# EasyEDA schematic HAT-MAGIC-HOOVER-BASE.json
TITLE: Sheet_1; REV: 1.0; Date: 2024-09-30; Sheet: 1/1; Drawn By: SMHOSY; Company: Your Company
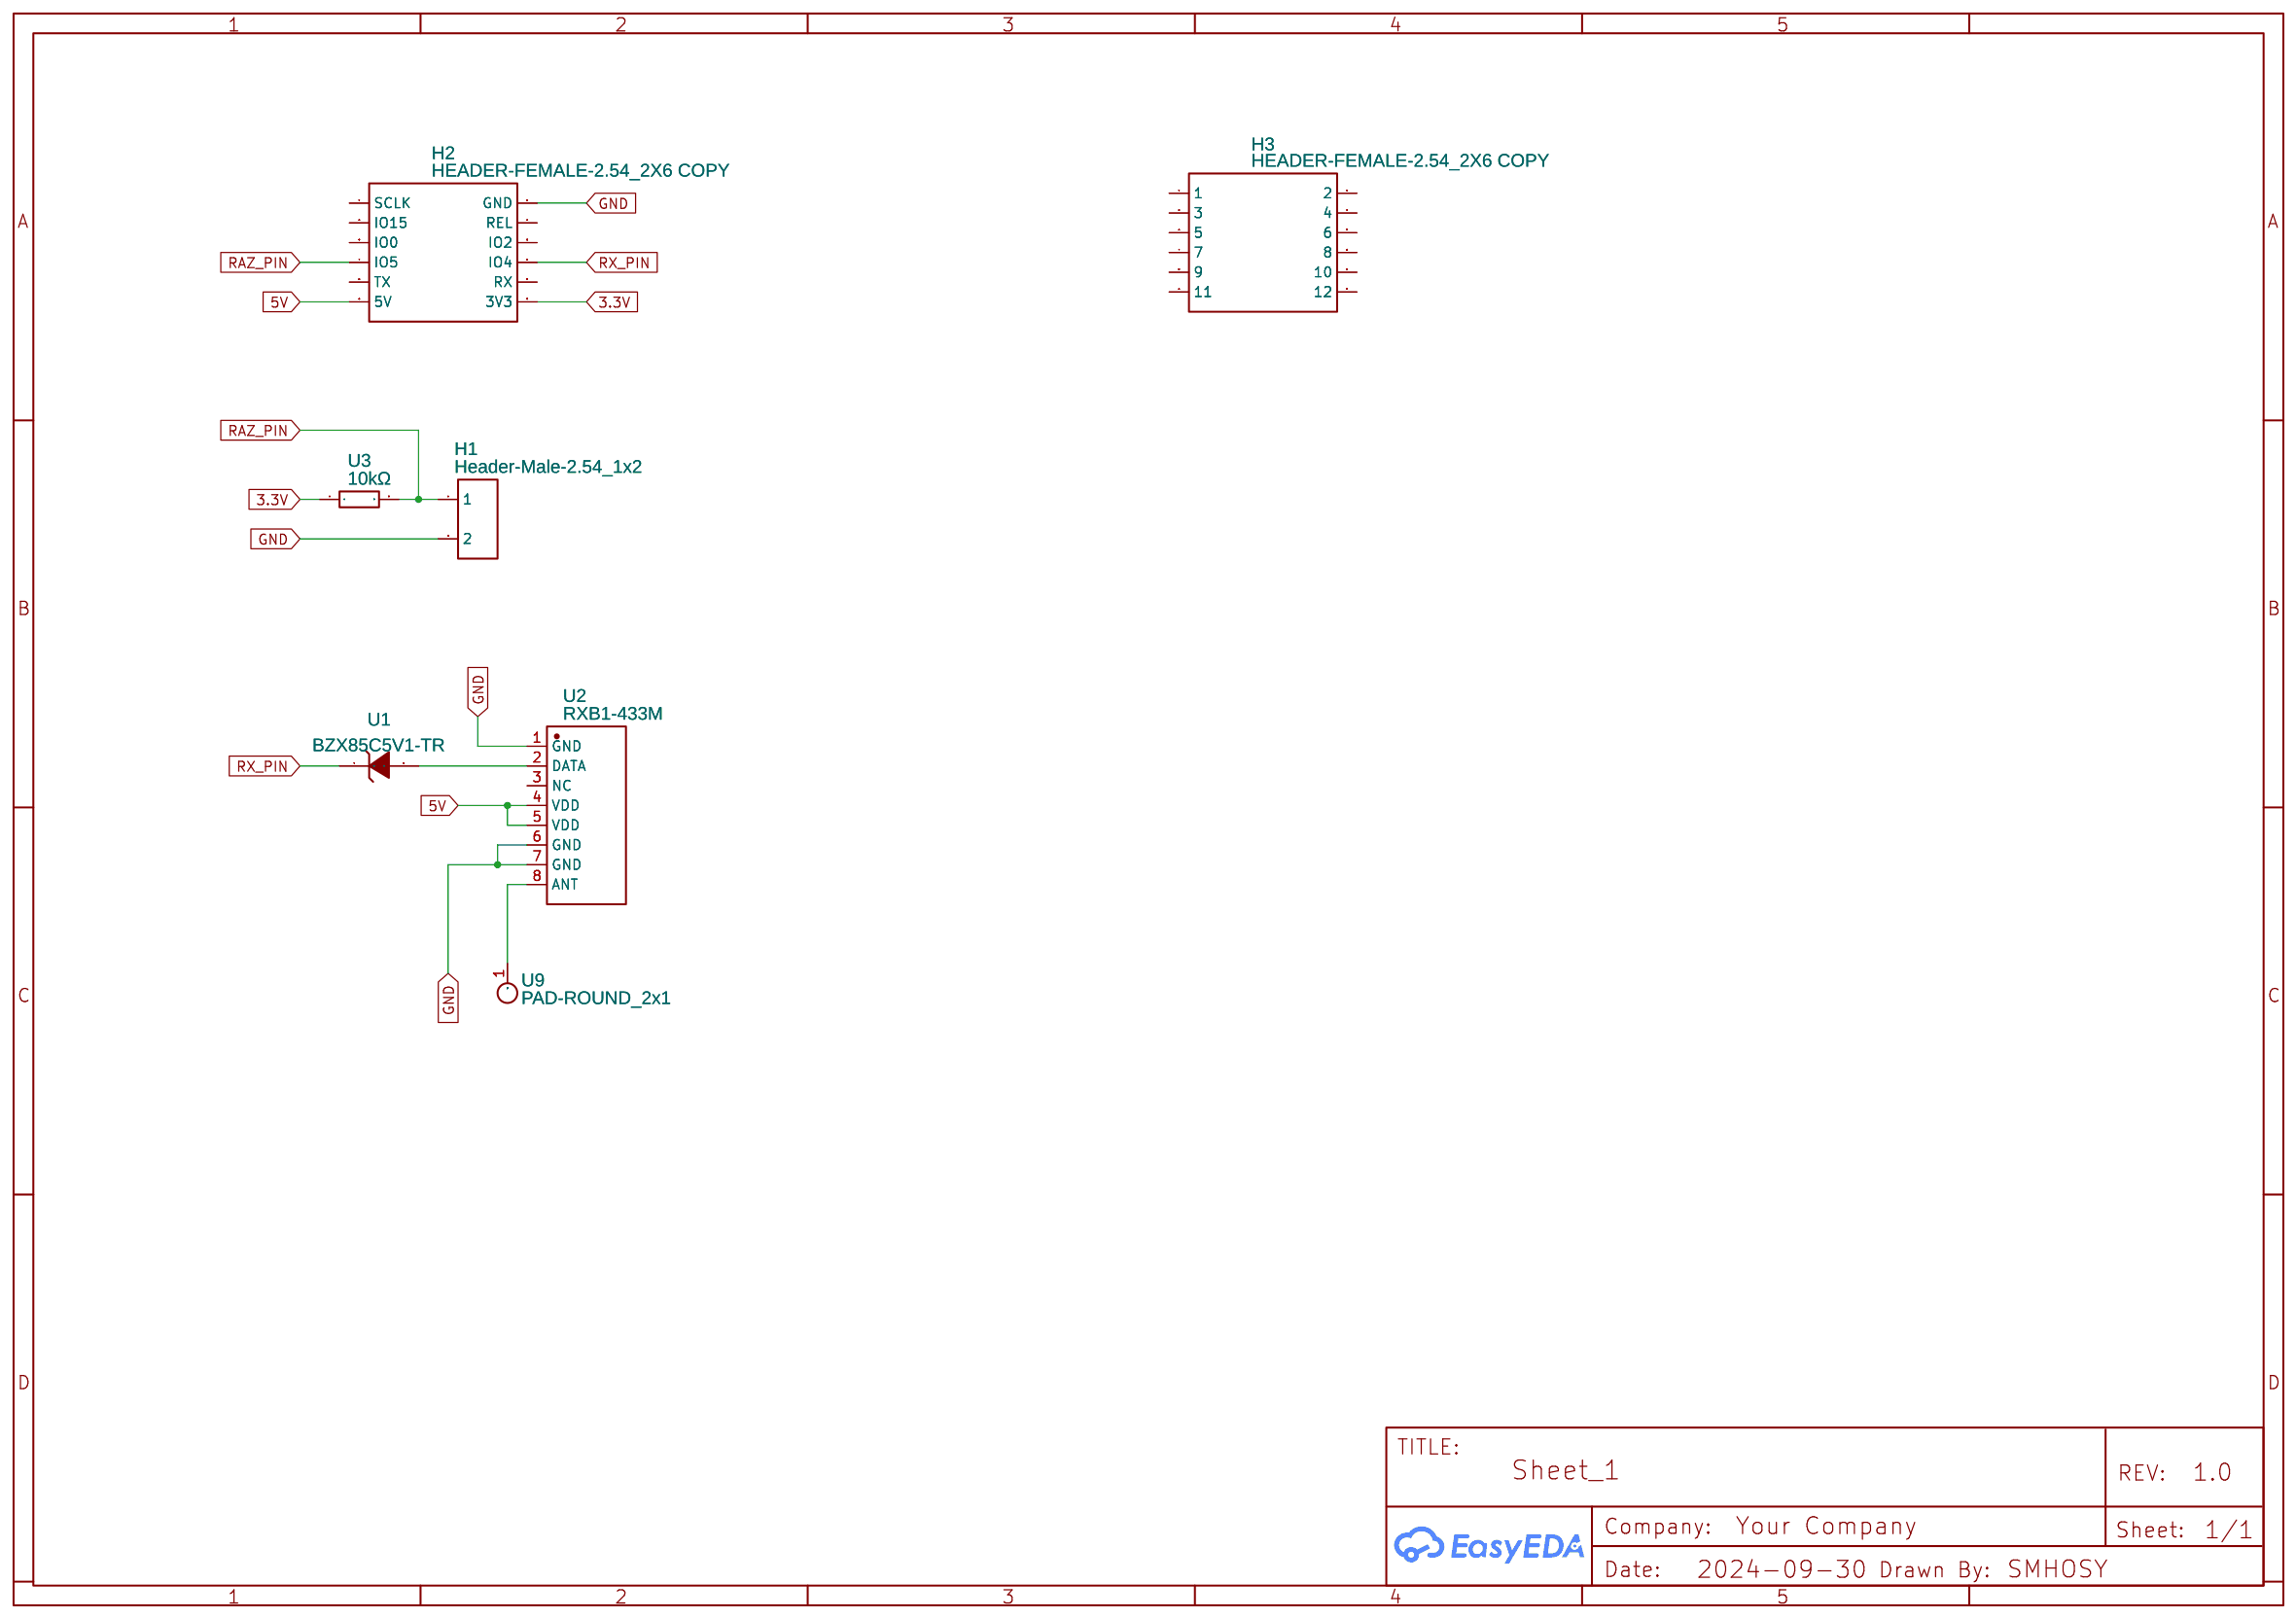
[diagram p0: schematic sheet]

## Parts
H1  Header-Male-2.54_1x2  [HDR-TH_2P-P2.54-V-M-1]
H2  HEADER-FEMALE-2.54_2X6 COPY  [HDR-TH_12P-P2.54-V-F-R2-C6-S2.54]
H3  HEADER-FEMALE-2.54_2X6 COPY  [HDR-TH_12P-P2.54-V-F-R2-C6-S2.54]
U1  BZX85C5V1-TR  [DO-41_BD1.9-L3.3-P7.30-D0.8-RD]
U2  RXB1-433M  [WIRELM-TH_RXB1-433M]
U3  10kΩ  [R1206]
U9  PAD-ROUND_2x1  [PADPAD]

## Library data of the parts
H1 = Header-Male-2.54_1x2: Supplier: LCSC; Manufacturer: TE Connectivity(泰科电子); Manufacturer Part: 826629-2; Supplier Part: C86471; JLCPCB Part Class: Extended Part
H2 H3 = HEADER-FEMALE-2.54_2X6 COPY: Supplier: LCSC; Manufacturer: BOOMELE(博穆精密); Manufacturer Part: 2.54-2*6P母; Supplier Part: C36191; JLCPCB Part Class: Extended Part
U1 = BZX85C5V1-TR: Contributor: lcsc; Supplier: LCSC; Supplier Part: C3000843; Manufacturer: VISHAY(威世); JLCPCB Part Class: Extended Part
U2 = RXB1-433M: Contributor: LCSC; Supplier: LCSC; Supplier Part: C717940; Manufacturer: DreamLNK(骏晔科技); JLCPCB Part Class: Extended Part
U3 = HR1206J10KP05: Contributor: LCSC; Supplier: LCSC; Supplier Part: C175515; Manufacturer: EVER OHMS(天二科技); Manufacturer Part: HR1206J10K0P05Z; JLCPCB Part Class: Extended Part
U9 = PAD-ROUND_2x1: Contributor: hippenium

## Nets
3.3V: H2.12(3V3) U3.1
5V: H2.11(5V) U2.4(VDD) U2.5(VDD)
GND: H1.2 H2.2(GND) U2.1(GND) U2.6(GND) U2.7(GND)
RAZ_PIN: H1.1 H2.7(IO5) U3.2
RX_PIN: H2.8(IO4) U1.1(C)
Net-(U1-2): U1.2(A) U2.2(DATA)
Net-(U2-8): U2.8(ANT) U9.1(Pad)

Not connected (* = marked no-connect by the designer): H2 1(SCLK) 3(IO15) 4(REL) 5(IO0) 6(IO2) 9(TX) 10(RX); H3 1 2 3 4 5 6 7 8 9 10 11 12; U2 3(NC)
